# Altium schematic sheet LDO_regulator.SchDoc
size A4; SheetNumber: 4; SheetTotal: 13
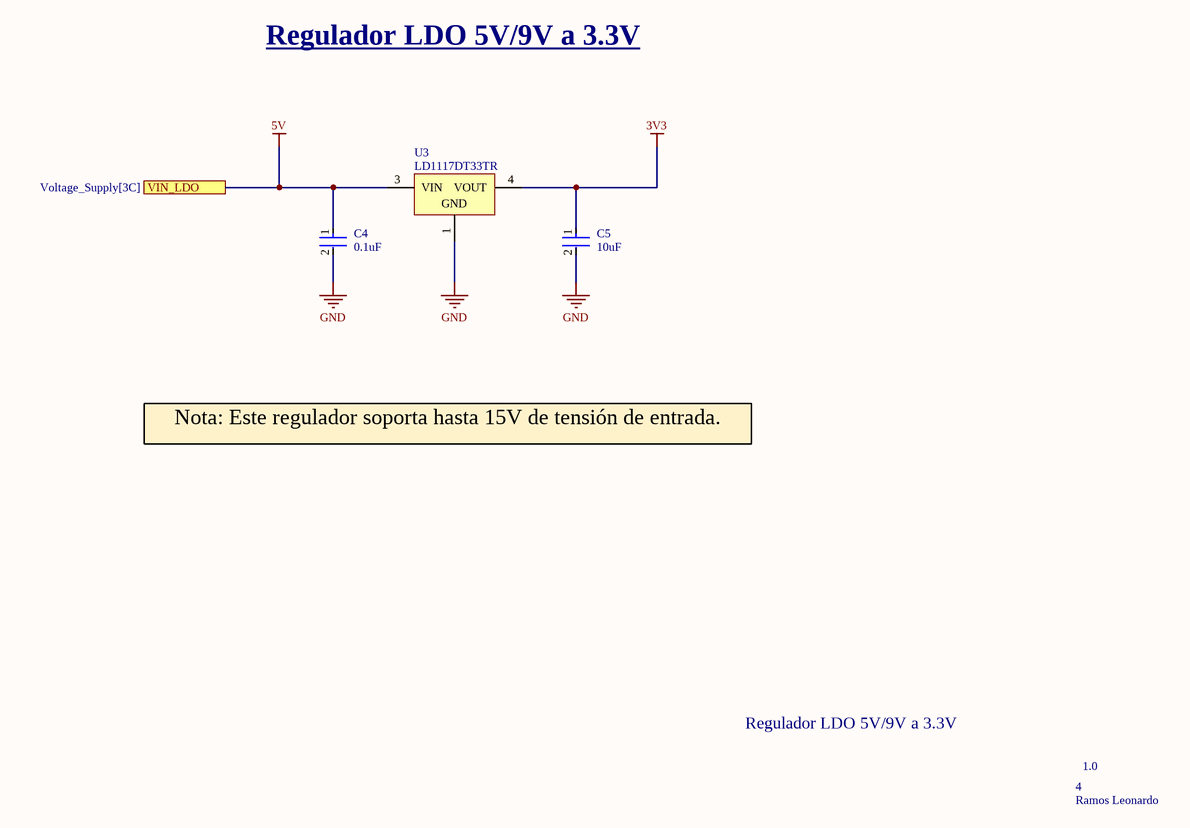
[diagram p0: LDO_regulator.SchDoc]

## Parts
C4  Capacitance: 0.1uF  [FP-GRM21B-0_1-IPC_B]  (hidden comment: 0.1u)
C5  Capacitance: 10uF  [FP-C0805C106J8RACAUTO-MFG]  (hidden comment: 10u)
U3  LD1117DT33TR  [TO-252_N]

## Ports
VIN_LDO (see Voltage_Supply[3C])

## Nets
3V3: C5.1 U3.4(VOUT)
5V: C4.1 U3.3(VIN) ; port VIN_LDO
GND: C4.2 C5.2 U3.1(GND)

## Notes on the sheet
- Regulador LDO 5V/9V a 3.3V
- Nota: Este regulador soporta hasta 15V de tensión de entrada.
- 4
- 1.0
- Ramos Leonardo

## Library data of the parts
C4 = CMP-06035-037063-1: Chip Multilayer Ceramic Capacitors for General Purpose, 0805, 0.10uF, U2J, -750ppm/°C, 5%, 10V; Depth: 1.25mm; Voltage Rating (DC): 10V; Voltage Rating: 10V; Length: 2mm; Max Operating Temperature: 125°C; Thickness: 0.053inch; Dielectric: U2J; Termination: SMD/SMT; Package Quantity: 3000; Packaging: Tape and Reel; Case Code (Metric): 2012; Tolerance: 5%; Case Code (Imperial): 0805; Case/Package: 0805; Mount: Surface Mount; Width: 0.049inch; Height: 1.25mm; Radiation Hardening: No; Min Operating Temperature: -55°C
C5 = CMP-03020-034708-1: CAP CER 10UF 10V X7R 0805; Tolerance: 5%; Mount: Surface Mount; Voltage Rating: 10V; Max Operating Temperature: 125°C; Min Operating Temperature: -55°C; Case/Package: 0805; RoHS Compliant: Yes; Packaging: Tape and Reel; Case Code (Imperial): 0805; Case Code (Metric): 2012; Ratings: AEC-Q200
U3 = LD1117DT33TR: Fixed Low Drop Positive Voltage Regulator, 3.3V, 3-Pin DPAK, Tape and Reel; ComponentLink1Description: Manufacturer URL; PackageVersion: 2011; PackageReference: TO-252; ComponentLink2Description: Datasheet; ComponentLink1URL: http://www.st.com; DatasheetVersion: 1/11/2011; PackageDescription: 3-Pin Transistor Outline Package 2.28 mm Pitch, 9.7 mm Lead Span (DPAK); ComponentLink2URL: http://www.st.com/internet/com/TECHNICAL_RESOURCES/TECHNICAL_LITERATURE/DATASHEET/CD00000544.pdf